# Altium schematic sheet ST_LINK.SCHDOC
size A4; DocumentNumber: 2; Revision: C.1(PCB.SCH); SheetNumber: 2; SheetTotal: 6
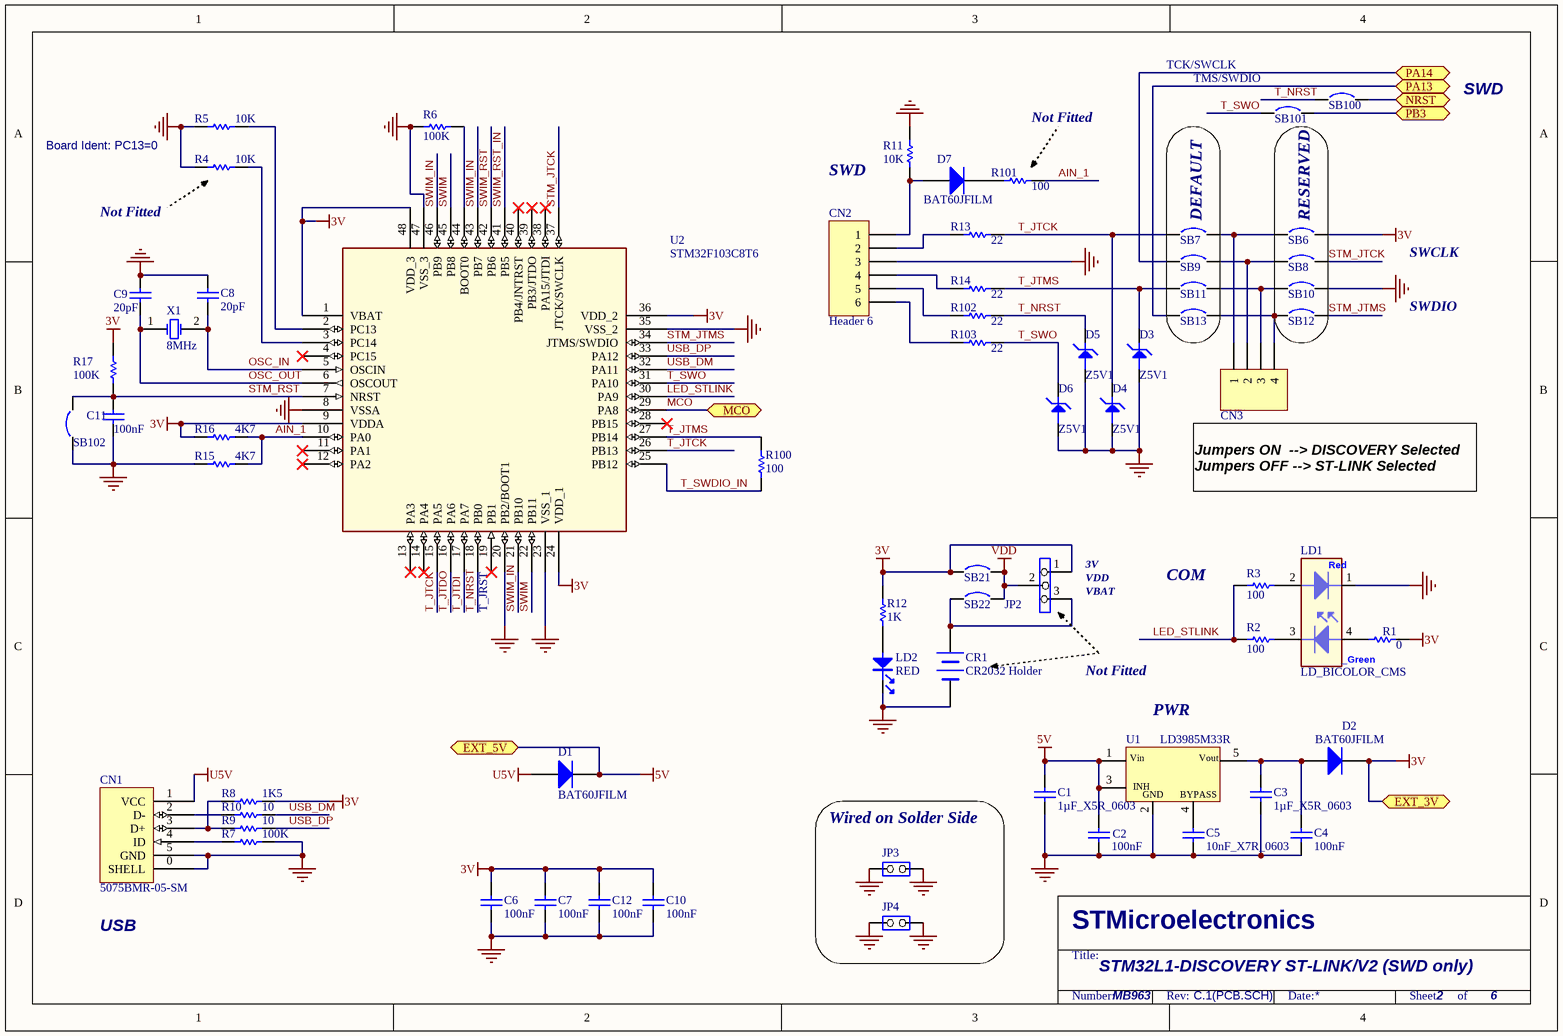
[diagram p0: ST_LINK.SCHDOC]

## Parts
C1  1µF_X5R_0603  [0603C]
C2  100nF  [0603C]
C3  1µF_X5R_0603  [0603C]
C4  100nF  [0603C]
C5  10nF_X7R_0603  [0603C]
C6  100nF  [0402C]
C7  100nF  [0402C]
C8  20pF  [0402C]
C9  20pF  [0402C]
C10  100nF  [0402C]
C11  100nF  [0402C]
C12  100nF  [0402C]
CN1  5075BMR-05-SM  [USB-MINI-B-SMD]
CN2  Header 6  [HDR1X6]
CN3  Header 4  [Header 4]  (value not drawn)
CR1  CR2032 Holder  [SOCKET BATTERY CR2032 (TRAV)]
D1  BAT60JFILM  [SOD323/A]
D2  BAT60JFILM  [SOD323/A]
D3  Z5V1  [SOT-23]
D4  Z5V1  [SOT-23]
D5  Z5V1  [SOT-23]
D6  Z5V1  [SOT-23]
D7  BAT60JFILM  [SOD323/A]
JP2  (no value)  [SIP3]
JP3  (no value)  [SIP2/2.54]
JP4  (no value)  [SIP2/2.54]
LD1  LD_BICOLOR_CMS  [HSMF-A201]
LD2  RED  [0603D]
R1  0  [0402R]
R2  100  [0402R]
R3  100  [0402R]
R4  10K  [0402R]
R5  10K  [0402R]
R6  100K  [0402R]
R7  100K  [0402R]
R8  1K5  [0402R]
R9  10  [0603R]
R10  10  [0603R]
R11  10K  [0402R]
R12  1K  [0402R]
R13  22  [0402R]
R14  22  [0402R]
R15  4K7  [0402R]
R16  4K7  [0402R]
R17  100K  [0402R]
R100  100  [0402R]
R101  100  [0402R]
R102  22  [0402R]
R103  22  [0402R]
SB6  Circuit Breaker  [JP2_SMD]  (value not drawn)
SB7  Circuit Breaker  [JP2_SMD]  (value not drawn)
SB8  Circuit Breaker  [JP2_SMD]  (value not drawn)
SB9  Circuit Breaker  [JP2_SMD]  (value not drawn)
SB10  Circuit Breaker  [JP2_SMD]  (value not drawn)
SB11  Circuit Breaker  [JP2_SMD]  (value not drawn)
SB12  Circuit Breaker  [JP2_SMD]  (value not drawn)
SB13  Circuit Breaker  [JP2_SMD]  (value not drawn)
SB21  Circuit Breaker  [JP2_SMD]  (value not drawn)
SB22  Circuit Breaker  [JP2_SMD]  (value not drawn)
SB100  Circuit Breaker  [JP2_SMD]  (value not drawn)
SB101  Circuit Breaker  [JP2_SMD]  (value not drawn)
SB102  Circuit Breaker  [JP2_SMD]  (value not drawn)
U1  LD3985M33R  [SOT-23-5L]
U2  STM32F103C8T6  [QFP48 7X7]
X1  8MHz  [XTAL1]

## Blocks framed on the sheet
DEFAULT: SB7 SB9 SB11 SB13
RESERVED: SB6 SB8 SB10 SB12
Wired on Solder Side: JP3 JP4

## Ports
EXT_3V, EXT_5V, MCO, NRST, PA13, PA14, PB3

## Nets
3V: C6.2 C7.2 C10.2 C12.1 D2.2(K) JP2.1 R1.2 R8.2 R12.2 R16.1 R17.2 SB6.2 SB21.1 U2.1(VBAT) U2.9(VDDA) U2.24(VDD_1) U2.36(VDD_2) U2.48(VDD_3) ; port EXT_3V
5V: C1.2 C2.2 D1.2(K) U1.1(Vin) U1.3(CE) ; port EXT_5V
GND: C1.1 C2.1 C3.2 C4.1 C5.1 C6.1 C7.1 C8.1 C9.1 C10.1 C11.1 C12.2 CN1.0(SHELL) CN1.5(GND) CN2.3 CR1.2(-) D3.2 D4.2 D5.2 D6.2 JP3.1(COMMON) JP3.2(NO) JP4.1(COMMON) JP4.2(NO) LD1.1 LD2.2 R4.1 R5.1 R6.1 R7.2 R11.2 R15.1 SB10.2 SB102.1 U1.2(GND) U2.8(VSSA) U2.20(PB2/BOOT1) U2.23(VSS_1) U2.35(VSS_2) U2.47(VSS_3)
U5V: CN1.1(VCC) D1.1(A)
VDD: JP2.2 SB21.2 SB22.2
AIN_1: R15.2 R16.2 R101.2 U2.10(PA0)
LED_STLINK: R2.1 R3.1 U2.30(PA9)
MCO: U2.29(PA8) ; port MCO
NRST: SB100.2 ; port NRST
OSC_IN: C8.2 U2.5(OSCIN) X1.2(OSC2)
OSC_OUT: C9.2 U2.6(OSCOUT) X1.1(OSC1)
PA13: SB13.1 ; port PA13
PA14: SB9.1 ; port PA14
PB3: SB101.2 ; port PB3
STM_JTCK: SB8.2 U2.37(JTCK/SWCLK)
STM_JTMS: SB12.2 U2.34(JTMS/SWDIO)
STM_RST: C11.2 R17.1 SB102.2 U2.7(NRST)
SWIM: U2.22(PB11) U2.45(PB8)
SWIM_IN: U2.21(PB10) U2.43(PB7) U2.46(PB9)
SWIM_RST: U2.42(PB6)
SWIM_RST_IN: U2.41(PB5)
T_JTCK: D4.3 R13.2 SB7.1 U2.15(PA5) U2.26(PB13)
T_JTDI: U2.17(PA7)
T_JTDO: U2.16(PA6)
T_JTMS: D3.3 R14.2 R100.2 SB11.1 U2.27(PB14)
T_NRST: D5.3 R102.2 SB100.1 U2.18(PB0)
T_SWDIO_IN: R100.1 U2.25(PB12)
T_SWO: D6.3 R103.2 SB101.1 U2.31(PA10)
USB_DM: R10.2 U2.32(PA11)
USB_DP: R9.2 U2.33(PA12)
NetC3_1: C3.1 C4.2 D2.1(A) U1.5(Vout)
NetC5_2: C5.2 U1.4(BYPASS)
NetCN1_2: CN1.2(D-) R10.1
NetCN1_3: CN1.3(D+) R8.1 R9.1
NetCN1_4: CN1.4(ID) R7.1
NetCN2_1: CN2.1 D7.1(A) R11.1
NetCN2_2: CN2.2 R13.1
NetCN2_4: CN2.4 R14.1
NetCN2_5: CN2.5 R102.1
NetCN2_6: CN2.6 R103.1
NetCN3_1: CN3.1 SB6.1 SB7.2
NetCN3_2: CN3.2 SB8.1 SB9.2
NetCN3_3: CN3.3 SB10.1 SB11.2
NetCN3_4: CN3.4 SB12.1 SB13.2
NetCR1_1: CR1.1(+) JP2.3 SB22.1
NetD7_2: D7.2(K) R101.1
NetLD1_2: LD1.2 R3.2
NetLD1_3: LD1.3 R2.2
NetLD1_4: LD1.4 R1.1
NetLD2_1: LD2.1 R12.1
NetR4_2: R4.2 U2.3(PC14)
NetR5_2: R5.2 U2.2(PC13)
NetR6_2: R6.2 U2.44(BOOT0)

Not connected (* = marked no-connect by the designer): U2 4(PC15)* 11(PA1)* 12(PA2)* 13(PA3)* 14(PA4)* 19(PB1)* 28(PB15)* 38(PA15/JTDI)* 39(PB3/JTDO)* 40(PB4/JNTRST)*

## Notes on the sheet
- TCK/SWCLK
- (near SB101) TMS/SWDIO
- SWD
- Board Ident: PC13=0
- Not Fitted
- SWCLK
- SWDIO
- Jumpers ON  --> DISCOVERY Selected
  Jumpers OFF --> ST-LINK Selected
- (near JP2) 3V
- (near JP2) VDD
- COM
- (near U2) T_JRST
- (near JP2) VBAT
- (near U1) PWR
- USB
- STM32L1-DISCOVERY ST-LINK/V2 (SWD only)
- MB963
- STMicroelectronics
- Title:
- Number:
- Rev:
- Date:
- Sheet       of
- (in symbol LD3985) INH
- (in symbol LD_BICOLOR_CMS) Red; _Green

## Library data of the parts
C1 C3 = CAP SMD 0603  X5R 1µF 25V 10%: 0603  X5R 1µF; Rated voltage: 25V; Tolerance: 10%; Manufacturer: *; Manufacturer P/N: *; Order code Farnell: 1288202RL; Value: 1µF; Power: *; Technology: X5R; Temperature  Factor: *; Temperature Max: +125°C; Temperature Min: -55°C; STS Code: *
C2 C4 C6-C12 = Cap: Capacitor; Published: 8-Jun-2000; Revision: July-2002: Re-released for DXP Platform.; Publisher: Altium Limited
  C2 C4 C6 C7 C10-C12: Value: 100nF
  C8 C9: Value: 20pF
C5 = CAP SMD 0603  X7R 10000PF 50V 10%: 0603  X7R 10NF; Order code RS: 2040779; Rated voltage: 50V; Tolerance: 10%; Order code Farnell: 7569548RL; Value: 10NF; Power: *; Technology: X7R; Temperature Factor: *; Temperature Min: -55°C; Temperature Max: +125°C; STS Code: *
CN1 = USB-MINI-typeB connector
CN2 = Header 6: Header, 6-Pin; LatestRevisionDate: 17-Jul-2002; LatestRevisionNote: Re-released for DXP Platform.; Publisher: Altium Limited
CN3 = Header 4: Header, 4-Pin; Revision: 17-Jul-2002: Re-released for DXP Platform.; Publisher: Altium Limited
CR1 = BATTERY: Battery CR2032 with SOCKET; Manuf_1: Lotes; Manuf_Part_1: KB7410AP2L; Description: CR2032 socket and battery, KB7410AP2L; Fitted: NO; Footprint: CR2032/SMT; Dristrib: http://www.bestbattery.co.kr/lotes/lotes.htm
D1 D2 D7 = Diode: Default Diode; Code - JEDEC: DO-214-AB; Provided: ST; Published: 8-Jun-2000; Revision: July-2002: Re-released for DXP Platform.; Publisher: Altium Limited
D3-D6 = Z5V6: BZX84-C5V6; Fitted: NO
JP2 = Jumper3: Fitted: NO
JP3 JP4 = JP2
LD1 = LD_BICOLOR_CMS: Bicolor Led; Manuf_Part_1: HSMF-A201-A00J1; Manuf_1: Avago Technologies; Ref St: xxxxxx; cap_dec: ----; Distrib: RADIOSPARES; support: ----
LD2 = PHOTO
R1-R3 R5-R17 R100 R102 R103 = res1: Resistor; Published: 8-Jun-2000; Revision: July-2002: Re-released for DXP Platform.; Publisher: Altium Limited
  R1: Value: 0
  R2 R3 R100: Value: 100
  R5 R11: Value: 10K
  R6 R7 R17: Value: 100K
  R8: Value: 1K5
  R9 R10: Value: 10
  R12: Value: 1K
  R13 R14 R102 R103: Value: 22
  R15 R16: Value: 4K7
R4 R101 = res1: Resistor; Fitted: NO; Published: 8-Jun-2000; Revision: July-2002: Re-released for DXP Platform.; Publisher: Altium Limited
  R4: Value: 10K
  R101: Value: 100
SB6 SB8 SB10 SB12 SB21 SB100 SB101 = Circuit Breaker: Solder: YES; Published: 24-Mar-1999; Revision: July-2002: Re-released for DXP Platform.; Publisher: Altium Limited
SB7 SB9 SB11 SB13 SB22 SB102 = Circuit Breaker: Solder: NO; Published: 24-Mar-1999; Revision: July-2002: Re-released for DXP Platform.; Publisher: Altium Limited
U1 = LD3985: Manuf_1: STM; Provided: ST; Manuf_Part1: LD3985M33R
U2 = STM32F103C8T6: Manuf_1: STM; Ref St: 9175981; Provided: ST; Manuf_Part_1: STM32F103C8T6
X1 = XTAL: Crystal Oscillator; Published: 8-Jun-2000; LatestRevisionDate: 17-Jul-2002; LatestRevisionNote: Re-released for DXP Platform.; PackageReference: R38; Publisher: Altium Limited